# Altium schematic sheet P13 MIC & AUDIO.SchDoc
size 297 x 209 mm
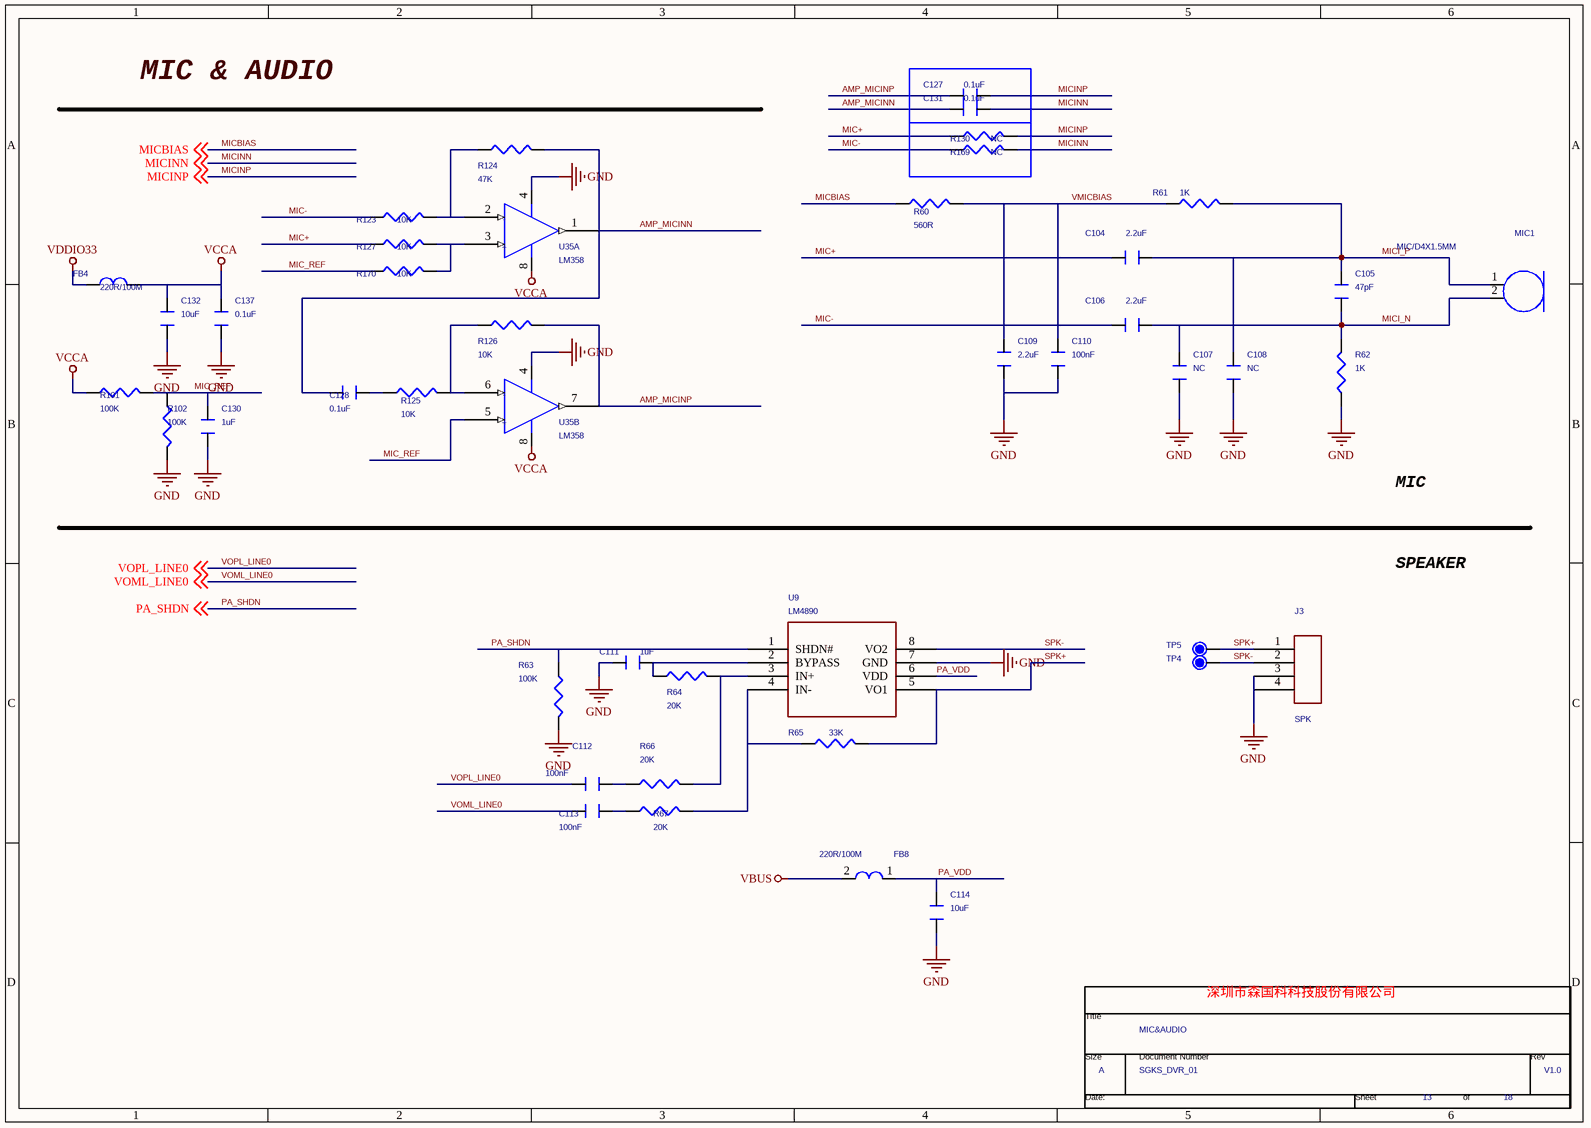
[diagram p0: P13 MIC & AUDIO.SchDoc]

## Parts
*  Page Count: 18  Page Number: 13  Page Size: A  Title: MIC&AUDIO  RevCode: V1.0  Doc: SGKS_DVR_01  (hidden comment: TitleBlock0)  (graphical)
C104  2.2uF  [C0402]
C105  47pF  [C0402]
C106  2.2uF  [C0402]
C107  NC  [C0402]
C108  NC  [C0402]
C109  2.2uF  [C0402]
C110  100nF  [C0402]
C111  1uF  [C0402]
C112  100nF  [C0402]
C113  100nF  [C0402]
C114  10uF  [C0603]
C127  0.1uF  [C0402]
C128  0.1uF  [C0402]
C130  1uF  [C0402]
C131  0.1uF  [C0402]
C132  10uF  [C0603]
C137  0.1uF  [C0402]
FB4  220R/100M  [0805]
FB8  220R/100M  [L0603]
J3  SPK  [SM_125X2_180]
MIC1  MIC/D4X1.5MM  [MIC-2DP]
R60  560R  [R0402]
R61  1K  [R0402]
R62  1K  [R0402]
R63  100K  [R0402]
R64  20K  [R0402]
R65  33K  [R0402]
R66  20K  [R0402]
R67  20K  [R0402]
R101  100K  [R0402]
R102  100K  [R0402]
R123  10K  [R0402]
R124  47K  [R0402]
R125  10K  [R0402]
R126  10K  [R0402]
R127  10K  [R0402]
R130  NC  [R0402]
R169  NC  [R0402]
R170  10K  [R0402]
TP4  SPK_  [TP/SMD/D1.0]  (value not drawn)
TP5  spk+  [TP/SMD/D1.0]  (value not drawn)
U9  LM4890  [MSOP8]
U35  LM358  [SOT96-1]  (parts A,B of 2)

## Nets
GND: C107.1 C108.1 C109.1 C110.1 C111.1 C114.1 C130.1 C132.1 C137.1 J3.3 J3.4 R62.1 R63.2 R102.2 U9.7(GND) U35.4(GND)
VBUS: FB8.2
VCCA: C132.2 C137.2 FB4.2 R101.1 U35.8(VCC)
VDDIO33: FB4.1
AMP_MICINN: C128.1 C131.1 R124.2 U35.1(OUT)
AMP_MICINP: C127.1 R126.2 U35.7(OUT)
MIC+: C104.1 R127.1 R130.1
MIC-: C106.1 R123.1 R169.1
MIC_REF: C130.2 R101.2 R102.1 R170.1 U35.5(+IN)
MICBIAS: R60.1 ; off-sheet MICBIAS
MICI_N: C105.1 C106.2 C107.2 MIC1.2 R62.2
MICI_P: C104.2 C105.2 C108.2 MIC1.1 R61.2
MICINN: C131.2 R169.2 ; off-sheet MICINN
MICINP: C127.2 R130.2 ; off-sheet MICINP
PA_SHDN: R63.1 U9.1(SHDN#) ; off-sheet PA_SHDN
PA_VDD: C114.2 FB8.1 U9.6(VDD)
SPK+: J3.1 R65.2 TP5.1 U9.5(VO1)
SPK-: J3.2 TP4.1 U9.8(VO2)
VMICBIAS: C109.2 C110.2 R60.2 R61.1
VOML_LINE0: C113.1 ; off-sheet VOML_LINE0
VOPL_LINE0: C112.1 ; off-sheet VOPL_LINE0
NetC111_2: C111.2 R64.1 U9.2(BYPASS)
NetC112_2: C112.2 R66.1
NetC113_2: C113.2 R67.1
NetC128_2: C128.2 R125.1
NetR64_2: R64.2 R66.2 U9.3(IN+)
NetR65_1: R65.1 R67.2 U9.4(IN-)
NetR123_2: R123.2 R124.1 U35.2(-IN)
NetR125_2: R125.2 R126.1 U35.6(-IN)
NetR127_2: R127.2 R170.2 U35.3(+IN)

## Notes on the sheet
- MIC & AUDIO
- MIC
- SPEAKER
- 深圳市森国科科技股份有限公司
- (in symbol LM358_0, part A) -; +
- (in symbol LM358_0, part B) -; +
- (in symbol TitleBlock0) Title; Size; Document Number; Rev; Date:; Sheet; of

## Library data of the parts
C104-C110 C127 C128 C130-C132 C137 = CAPACITOR_0_Dup3
C111 = CAPACITOR_0_Dup2: 规格型号: 原材料; 元件类别: 电容1UF/6.3V,X5R,±10%,0402 每盘10K; 元件编号: 电容; 备注: YCL0457; PAGE: 1; Vendor: C0402
C112 = CAPACITOR_0_Dup2: PAGE: 1; 备注: YCL0816; 元件编号: 电容; 元件类别: 电容470nF/10V,X5R,±10%,0402 每盘10K; 规格型号: 原材料; Vendor: C0402
C113 = CAPACITOR_0_Dup2: 规格型号: 原材料; 元件类别: 电容470nF/10V,X5R,±10%,0402 每盘10K; 元件编号: 电容; 备注: YCL0816; PAGE: 1; Vendor: C0402
C114 = CAPACITOR_0_Dup2: 规格型号: 原材料; 元件类别: 电容2.2UF/6.3V,X5R,±20%,0402 每盘10K; 元件编号: 电容; Vendor: C0402; 备注: YCL0302; PAGE: 1
FB4 = Ferrite BEAD
FB8 = INDUCTOR_0: RoHS BEAD/600ohm 100Mhz Z=600Ω DCR<0.2Ω 800mA SMT L0603; OriginalSymbolOrigin: (10,0); Pin Names Rotate: TRUE; Pin Names Visible: FALSE; Pin Numbers Visible: TRUE; Package: SMT
J3 = CON4
MIC1 = MIC_0: Type: 麦克风
R60-R62 R123-R127 R130 R169 R170 = RESISTOR_Dup2
R63 R101 R102 = ?_0: 备注: YCL0465; 元件编号: 电阻; 元件类别: 电阻100K,±5%,1/16W,0402 每盘10K; 规格型号: 原材料; Vendor: R0402
R64 R66 = ?_0: 规格型号: 原材料; 元件类别: 电阻20K,±5%,1/16W,0402 每盘10K; 元件编号: 电阻; 备注: YCL0479; Vendor: R0402
R65 = ?_0: 规格型号: 原材料; 元件类别: 电阻33K,±5%,1/16W,0402 每盘10K; 元件编号: 电阻; 备注: YCL0466; Vendor: R0402
R67 = ?_0: 备注: YCL0479; 元件编号: 电阻; 元件类别: 电阻20K,±5%,1/16W,0402 每盘10K; 规格型号: 原材料; Vendor: R0402
TP4 TP5 = TP_0: Part Description: Test Point; Type: NC
U9 = LY8006_0: 备注: YCL0064; 元件编号: IC; 元件类别: 功放IC4890 / TF690; 规格型号: 原材料; Vendor: MSOP8
U35 = LM358_0
* = TitleBlock0: Page Create Date: March  8, 1995